# Altium project PumpDriver.PrjPcb
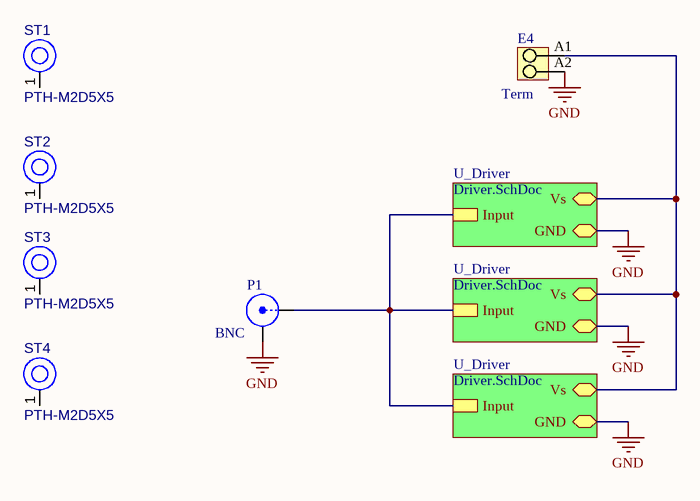
[diagram p0: PumpDriver.SchDoc]
2 sheets, 18 parts. Net scope: hierarchical (ports join the sheet entries above them; power ports are global).
Board file: PumpDriver.PcbDoc
Sheets:
  PumpDriver.SchDoc
    U_Driver = Driver.SchDoc
    U_Driver = Driver.SchDoc
    U_Driver = Driver.SchDoc

## Sheet PumpDriver.SchDoc
size A; SheetNumber: 1; SheetTotal: 2

### Parts
E4  Term  [PM_5_08_90_02]
P1  BNC  [TE_227161-1]
ST1  PTH-M2D5X5  [PTH-M2D5X5]
ST2  PTH-M2D5X5  [PTH-M2D5X5]
ST3  PTH-M2D5X5  [PTH-M2D5X5]
ST4  PTH-M2D5X5  [PTH-M2D5X5]

### Sub-sheets
U_Driver = Driver.SchDoc: Input, GND (bidir), Vs (bidir)
U_Driver = Driver.SchDoc: Input, GND (bidir), Vs (bidir)
U_Driver = Driver.SchDoc: Input, GND (bidir), Vs (bidir)

### Nets
GND: E4.A2 P1.2(Y) ; sheet U_Driver/GND, sheet U_Driver/GND, sheet U_Driver/GND
NetD1_U_Driver1_1: E4.A1 ; sheet U_Driver/Vs, sheet U_Driver/Vs, sheet U_Driver/Vs
NetP1_1: P1.1(X) ; sheet U_Driver/Input, sheet U_Driver/Input, sheet U_Driver/Input

Not connected (* = marked no-connect by the designer): ST1 1(H1); ST2 1(H1); ST3 1(H1); ST4 1(H1)

### Library data of the parts
E4 = CMP-1559-01627-1: OMNIMATE Signal - series PM; Manufacturer: Weidmueller; PartNumber: 1760490000; Contact_surface: tinned; Pitch_mm: 5,08 mm; Solid_min_H05_07_V_U: 0,13 mm²; Wire_cross_section_AWG_min_UL_1059: AWG 26; Wire_cross_section_AWG_max_UL_1059: AWG 14; Rated_voltage_for_surge_voltage_class_pollution_degree_II_2: 600 V; Rated_current_use_group_B_UL_1059: 15 A; Mounting_onto_the_PCB: Solder connection; Solder_pin_length_mm: 3,5 mm; Side_termination_characteristic: closed side; Contact_material: Cu-Leg; Pitch_inch: 0,2 inch; No_of_poles: 2; UL_94_flammability_rating: V-0; Insulating_material: Wemid (PA); Rated_voltage_use_group_B_UL_1059: 300 V; Solid_max_H05_07_V_U: 2,5 mm²; Short_text_for_material: PM 5.08/02/90 3.5SN OR BX; Revision: V1; Qty: 500 PCS; ComponentLink2Description: URL Link1; Packaging: Box; PackageReference: PM_5_08_90_02; ComponentLink2URL: http://catalog.weidmueller.com/catalog/Start.do?localeId=en&ObjectID=1760490000; Colour: Orange; ComponentLink1Description: Manufacturer URL; ComponentLink1URL: http://www.weidmueller.com/
P1 = BNC: BNC Elbow Connector; LatestRevisionDate: 17-Jul-2002; LatestRevisionNote: Re-released for DXP Platform.; Publisher: Altium Limited
ST1-ST4 = CMP-00028-00004-2: M2 PTH (2.5mm), 5mm pad; Pins: 1

## Sheet Driver.SchDoc
size A; SheetNumber: 2; SheetTotal: 2
Used 3 times, as channels U_Driver, U_Driver, U_Driver. Parts and nets are listed once, with the designators drawn on the sheet.
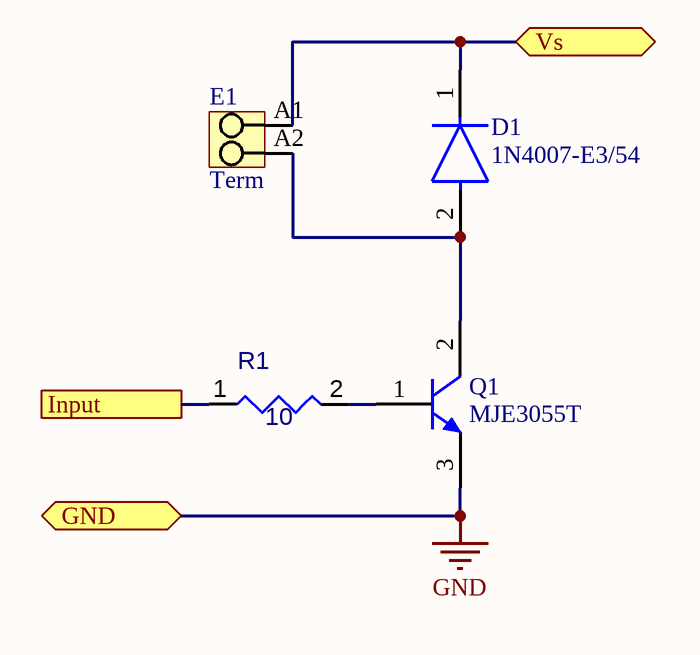
[diagram p1: Driver.SchDoc]

### Parts
D1  1N4007-E3/54  [FP-1N4007-MFG]
E1  Term  [PM_5_08_90_02]
Q1  MJE3055T  [ONSC-TO-220-3-221A-09]
R1  10  [RESA60-630X240]

### Ports
GND (bidir), Input, Vs (bidir)

### Nets
GND: Q1.3(E) ; port GND
Input: R1.1 ; port Input
Vs: D1.1(C) E1.A1 ; port Vs
NetD1_2: D1.2(A) E1.A2 Q1.2(C)
NetQ1_1: Q1.1(B) R1.2

### Channels
U_Driver: designators end in _U_Driver3; ports GND=GND Input=NetP1_1 Vs=NetD1_U_Driver1_1
U_Driver: designators end in _U_Driver2; ports GND=GND Input=NetP1_1 Vs=NetD1_U_Driver1_1
U_Driver: designators end in _U_Driver1; ports GND=GND Input=NetP1_1 Vs=NetD1_U_Driver1_1

### Library data of the parts
D1 = CMP-02540-000046-1: DIODE GEN PURP 1KV 1A DO204AL; Manufacturer: Vishay; Value: 15pF; Max Junction Temp: +150°C; Max Surge Forward Current: 30A; Max Repetitive Reverse Voltage: 1000V; Peak Reverse Current: 30uA; Octopart: https://octopart.com/1n4007-e3%2F54-vishay-39548207; Digikey Description: DIODE GEN PURP 1KV 1A DO204AL; Category: Diode; Mouser Description: Rectifiers Vr/1000V Io/1A; Automotive: No; Package: 1N4007; Device Class L3: Rectifier Diodes; Temperature Range High: +150°C; Capacitance: 15pF; Ipc Land Pattern Name: DIOPA1088W105L520D270; Lead Free: Yes; ComponentLink2Description: Datasheet; Forward Current: 1A; Device Class L1: Discrete Semiconductors; ComponentLink2URL: http://www.vishay.com/docs/88503/1n4001.pdf; Temperature Range Low: -50°C; Height: 2.7mm; RoHS: TRUE; Temperature: -50°C to +150°C; Device Class L2: Diodes; Manufacturer Part Number: 1N4007-E3/54
E1 = CMP-1559-01627-1: as E4 on sheet PumpDriver; Revision: V1; Qty: 500 PCS; ComponentLink2Description: URL Link1; Packaging: Box; PackageReference: PM_5_08_90_02; ComponentLink2URL: http://catalog.weidmueller.com/catalog/Start.do?localeId=en&ObjectID=1760490000; Colour: Orange; ComponentLink1Description: Manufacturer URL; ComponentLink1URL: http://www.weidmueller.com/
Q1 = CMP-1048-01152-1: Complementary Silicon Plastic Power Transistor, 3-Pin TO-220, Tube; Manufacturer: On Semiconductor; IC Continuous (A): 10; fT Min (MHz): 2; Polarity: NPN; Packing: Tube; ComponentLink3URL: http://www.onsemi.com/pub_link/Collateral/221A-09.PDF; RoHS: FALSE; PackageReference: TO-220-3-221A-09; Mounting Technology: Through Hole; DatasheetVersion: Rev. 11; ComponentLink2URL: http://www.onsemi.com/pub_link/Collateral/MJE2955T-D.PDF; ComponentLink1Description: Manufacturer URL; PartNumber: MJE3055T; PackageVersion: Rev. AG, 09/2011; PackageDescription: 3-Pin Flange Mount, Vertical Straight Lead, Body 9.97 x 4.445 mm, Pitch 2.54 mm; ComponentLink1URL: http://www.onsemi.com/; ComponentLink2Description: Datasheet; ComponentLink3Description: Package Specification
R1 = CMP-009-00059-4: Axial, 10ohm, 0.5W; Manufacturer: Yageo; Power: 250mW; Tolerance: 1%; Value: 4.75k; Voltage Rating: 250V; Case/Package: Axial; Composition: MetalFilm; Datasheet URL: http://www.yageo.com/documents/recent/Yageo%20LR_MFR_2013.pdf; Datasheet Version: Apr-13; Manufacturer URL: http://www.yageo.com/; Max Operating Temperature: 155°C; Min Operating Temperature: -55°C; Mounting Technology: TH; Package Description: 2-Pin Axial Lead, Dia 2.4 mm, Body Length 6.3 mm; Package Quantity: 200; Package Reference: MFR-25; Packaging: Bulk; RoHS Compliant: True

## Nets that join several sheets
GND: PumpDriver (E4.A2 P1.2), U_Driver (Q1_U_Driver3.3), U_Driver (Q1_U_Driver2.3), U_Driver (Q1_U_Driver1.3)
NetD1_U_Driver1_1: PumpDriver (E4.A1), U_Driver (D1_U_Driver3.1 E1_U_Driver3.A1), U_Driver (D1_U_Driver2.1 E1_U_Driver2.A1), U_Driver (D1_U_Driver1.1 E1_U_Driver1.A1)
NetP1_1: PumpDriver (P1.1), U_Driver (R1_U_Driver3.1), U_Driver (R1_U_Driver2.1), U_Driver (R1_U_Driver1.1)